# Altium project test_plate.PrjPcb
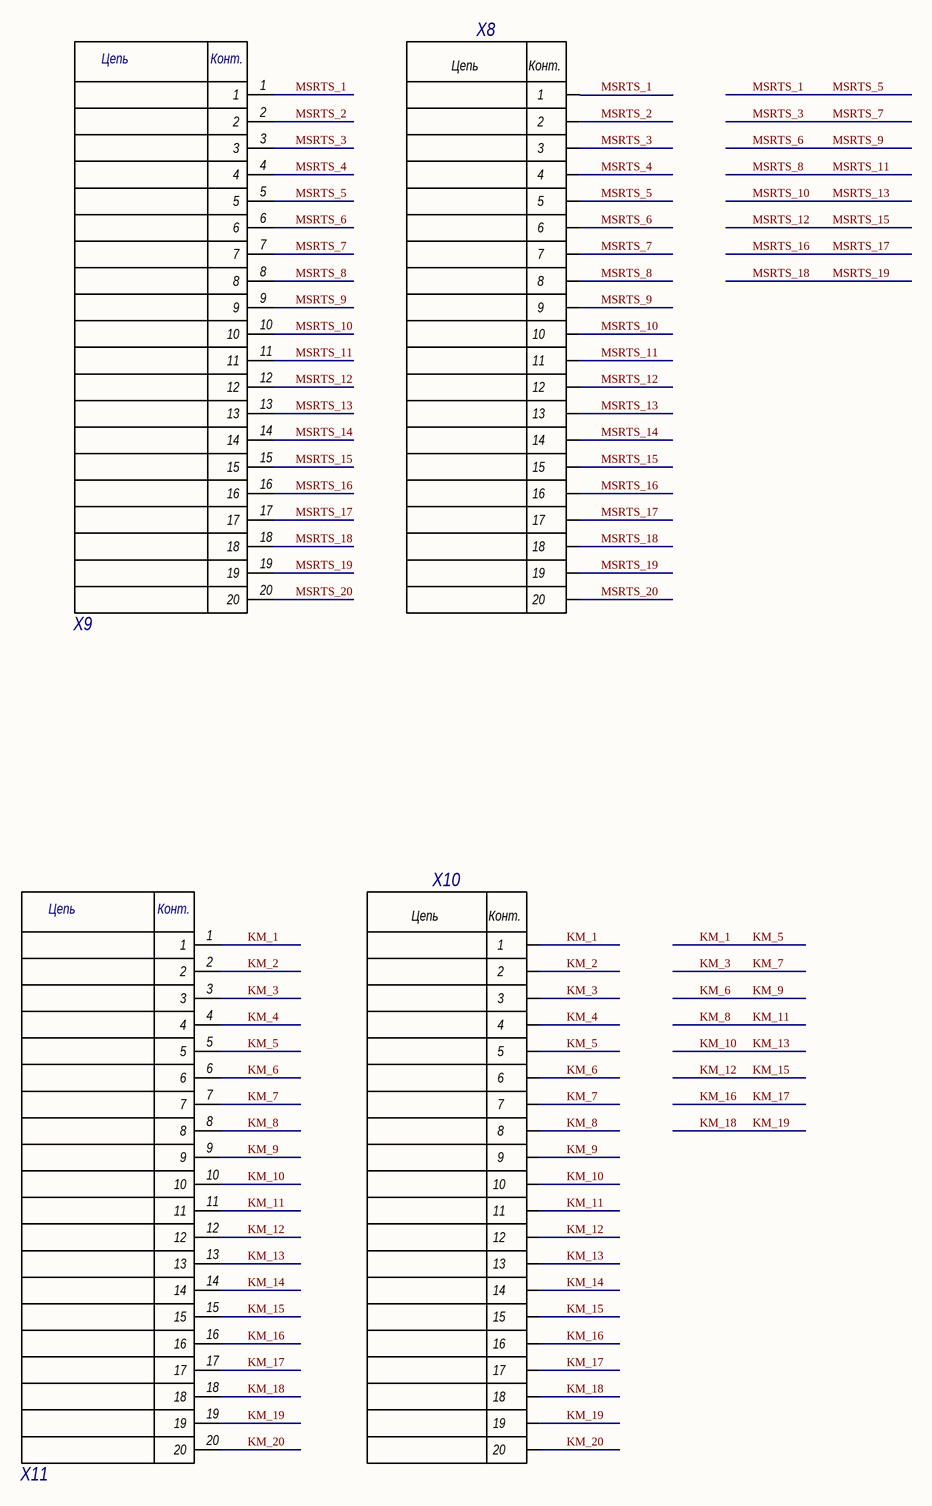
[diagram p0: KM+msrts.SchDoc]
4 sheets, 18 parts. Net scope: global (net labels, ports and power ports of the same name join across sheets).
Board file: test_plate.PcbDoc
Sheets:
  KM+msrts.SchDoc
  NKK+DOF.SchDoc
  SD_SC.SchDoc
  test.SchDoc

## Sheet KM+msrts.SchDoc
size A2

### Parts
X8  PLD-20  [PLD-20]  (value not drawn)
X9  2x10  [5011902017]  (value not drawn)
X10  PLD-20  [PLD-20]  (value not drawn)
X11  2x10  [5011902017]  (value not drawn)

### Nets
KM_1: X10.1 X10.5 X11.1 X11.5  [also labelled KM_5]
KM_2: X10.2 X11.2
KM_3: X10.3 X10.7 X11.3 X11.7  [also labelled KM_7]
KM_4: X10.4 X11.4
KM_6: X10.6 X10.9 X11.6 X11.9  [also labelled KM_9]
KM_10: X10.10 X10.13 X11.10 X11.13  [also labelled KM_13]
KM_11: X10.8 X10.11 X11.8 X11.11  [also labelled KM_8]
KM_12: X10.12 X10.15 X11.12 X11.15  [also labelled KM_15]
KM_14: X10.14 X11.14
KM_16: X10.16 X10.17 X11.16 X11.17  [also labelled KM_17]
KM_18: X10.18 X10.19 X11.18 X11.19  [also labelled KM_19]
KM_20: X10.20 X11.20
MSRTS_1: X8.1 X8.5 X9.1 X9.5  [also labelled MSRTS_5]
MSRTS_2: X8.2 X9.2
MSRTS_3: X8.3 X8.7 X9.3 X9.7  [also labelled MSRTS_7]
MSRTS_4: X8.4 X9.4
MSRTS_6: X8.6 X8.9 X9.6 X9.9  [also labelled MSRTS_9]
MSRTS_10: X8.10 X8.13 X9.10 X9.13  [also labelled MSRTS_13]
MSRTS_11: X8.8 X8.11 X9.8 X9.11  [also labelled MSRTS_8]
MSRTS_12: X8.12 X8.15 X9.12 X9.15  [also labelled MSRTS_15]
MSRTS_14: X8.14 X9.14
MSRTS_16: X8.16 X8.17 X9.16 X9.17  [also labelled MSRTS_17]
MSRTS_18: X8.18 X8.19 X9.18 X9.19  [also labelled MSRTS_19]
MSRTS_20: X8.20 X9.20

### Notes on the sheet
- (in symbol 5011902017) Цепь; Конт.
- (in symbol PLD-20 2.54mm) Цепь; Конт.

### Library data of the parts
X8 X10 = PLD-20 2.54mm: штыри на плату двурядные; PartNumberFrom1C: Штырь PLD-20; Код: 27; 1CType: Штырь; Number of Positions: 20; Pitch - Mating: 2,54 мм; System: Connector; PartNumber: PLD-20 2.54mm; PartNumberFrom1C_accuracy: Штырь PLD-20; OrderCode: PLD-20; Mounting Type: Through Hole; ComponentLink1Description: Технические характеристики
X9 X11 = 5011902017: CONN HEADER SMD 20POS 1MM; PartNumberFrom1C: Вилка Molex 5011902017; Manufacturer: Molex; Код: 181; 1CType: Вилка; Extended Price: $571.24/500; Number of Positions: 20; Number of Positions Loaded: ALL; Pitch - Mating: 0.039" (1.00mm); Row Spacing: 0.105" (2.66mm); System: Connector; PartNumber: 5011902017; PartNumberFrom1C_accuracy: Вилка Molex 5011902017; OrderCode: 5011902017; Unit Price: $1.76; Packaging: Cut Tape (CT); Series: Pico-Clasp 501190; Contact Type: Male Pin; Number of Rows: 2; Mounting Type: Surface Mount; Fastening Type: Latch Holder; Termination: Solder; Contact Finish Thickness: 3.90µin (0.099µm); ComponentLink: https://www.digikey.com/product-detail/en/molex/5011902017/WM7907CT-ND/1531557; ComponentLink1URL: https://www.digikey.com/product-detail/en/molex/5011902017/WM7907CT-ND/1531557; ComponentLink1Description: Технические характеристики

## Sheet NKK+DOF.SchDoc
size A4
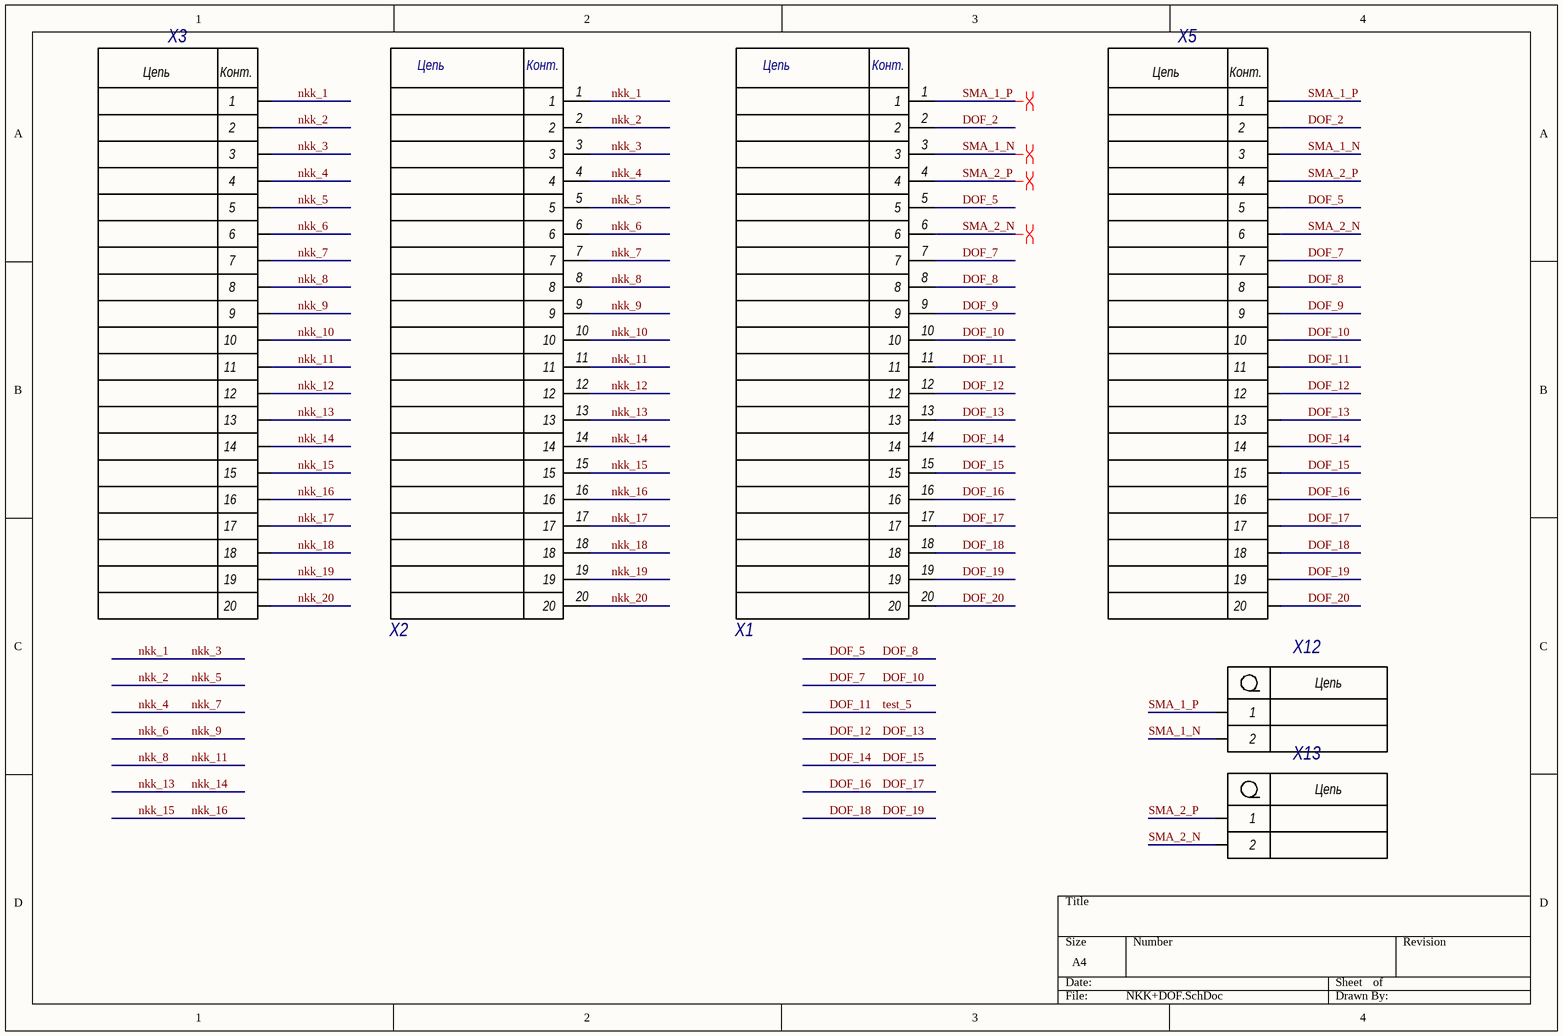
[diagram p1: NKK+DOF.SchDoc]

### Parts
X1  2x10  [5011902017]  (value not drawn)
X2  2x10  [5011902017]  (value not drawn)
X3  PLD-20  [PLD-20]  (value not drawn)
X5  PLD-20  [PLD-20]  (value not drawn)
X12  SMA JACK  [SMA_THROUGH_HOLE]  (value not drawn)
X13  SMA JACK  [SMA_THROUGH_HOLE]  (value not drawn)

### Nets
DOF_2: X1.2 X5.2
DOF_5: X1.5 X1.8 X5.5 X5.8  [also labelled DOF_8]
DOF_9: X1.9 X5.9
DOF_10: X1.7 X1.10 X5.7 X5.10  [also labelled DOF_7]
DOF_11: X1.11 X5.11  [also labelled test_5]
DOF_12: X1.12 X1.13 X5.12 X5.13  [also labelled DOF_13]
DOF_14: X1.14 X1.15 X5.14 X5.15  [also labelled DOF_15]
DOF_16: X1.16 X1.17 X5.16 X5.17  [also labelled DOF_17]
DOF_18: X1.18 X1.19 X5.18 X5.19  [also labelled DOF_19]
DOF_20: X1.20 X5.20
nkk_1: X2.1 X2.3 X3.1 X3.3  [also labelled nkk_3]
nkk_2: X2.2 X2.5 X3.2 X3.5  [also labelled nkk_5]
nkk_4: X2.4 X2.7 X3.4 X3.7  [also labelled nkk_7]
nkk_6: X2.6 X2.9 X3.6 X3.9  [also labelled nkk_9]
nkk_10: X2.10 X3.10
nkk_11: X2.8 X2.11 X3.8 X3.11  [also labelled nkk_8]
nkk_12: X2.12 X3.12
nkk_13: X2.13 X2.14 X3.13 X3.14  [also labelled nkk_14]
nkk_15: X2.15 X2.16 X3.15 X3.16  [also labelled nkk_16]
nkk_17: X2.17 X3.17
nkk_18: X2.18 X3.18
nkk_19: X2.19 X3.19
nkk_20: X2.20 X3.20
SMA_1_N: X1.3 X5.3 X12.2
SMA_1_P: X1.1 X5.1 X12.1
SMA_2_N: X1.6 X5.6 X13.2
SMA_2_P: X1.4 X5.4 X13.1

### Layout directives
differential pair: SMA_1_N, SMA_1_P, SMA_2_N, SMA_2_P

### Notes on the sheet
- (in symbol 5011902017) Цепь; Конт.
- (in symbol PLD-20 2.54mm) Цепь; Конт.
- (in symbol WM5543-ND) Цепь

### Library data of the parts
X1 X2 = 5011902017: as X9 on sheet KM+msrts; PartNumber: 5011902017; PartNumberFrom1C_accuracy: Вилка Molex 5011902017; OrderCode: 5011902017; Unit Price: $1.76; Packaging: Cut Tape (CT); Series: Pico-Clasp 501190; Contact Type: Male Pin; Number of Rows: 2; Mounting Type: Surface Mount; Fastening Type: Latch Holder; Termination: Solder; Contact Finish Thickness: 3.90µin (0.099µm); ComponentLink: https://www.digikey.com/product-detail/en/molex/5011902017/WM7907CT-ND/1531557; ComponentLink1URL: https://www.digikey.com/product-detail/en/molex/5011902017/WM7907CT-ND/1531557; ComponentLink1Description: Технические характеристики
X3 X5 = PLD-20 2.54mm: as X8 on sheet KM+msrts; PartNumber: PLD-20 2.54mm; PartNumberFrom1C_accuracy: Штырь PLD-20; OrderCode: PLD-20; Mounting Type: Through Hole; ComponentLink1Description: Технические характеристики
X12 X13 = WM5543-ND: CONN SMA JACK STR 50 OHM PCB; PartNumberFrom1C: Розетка Molex WM5543-ND; Manufacturer: Molex; Код: 52; 1CType: Розетка; Number of Positions: 1; System: Connector; PartNumber: WM5543-ND; PartNumberFrom1C_accuracy: Розетка Molex WM5543-ND; OrderCode: WM5543-ND; Mounting Type: Through Hole; ComponentLink: http://www.digikey.com/product-detail/en/0733910060/WM5543-ND/1465165; ComponentLink1URL: http://www.digikey.com/product-detail/en/0733910060/WM5543-ND/1465165; ComponentLink1Description: Технические характеристики

## Sheet SD_SC.SchDoc
size A4
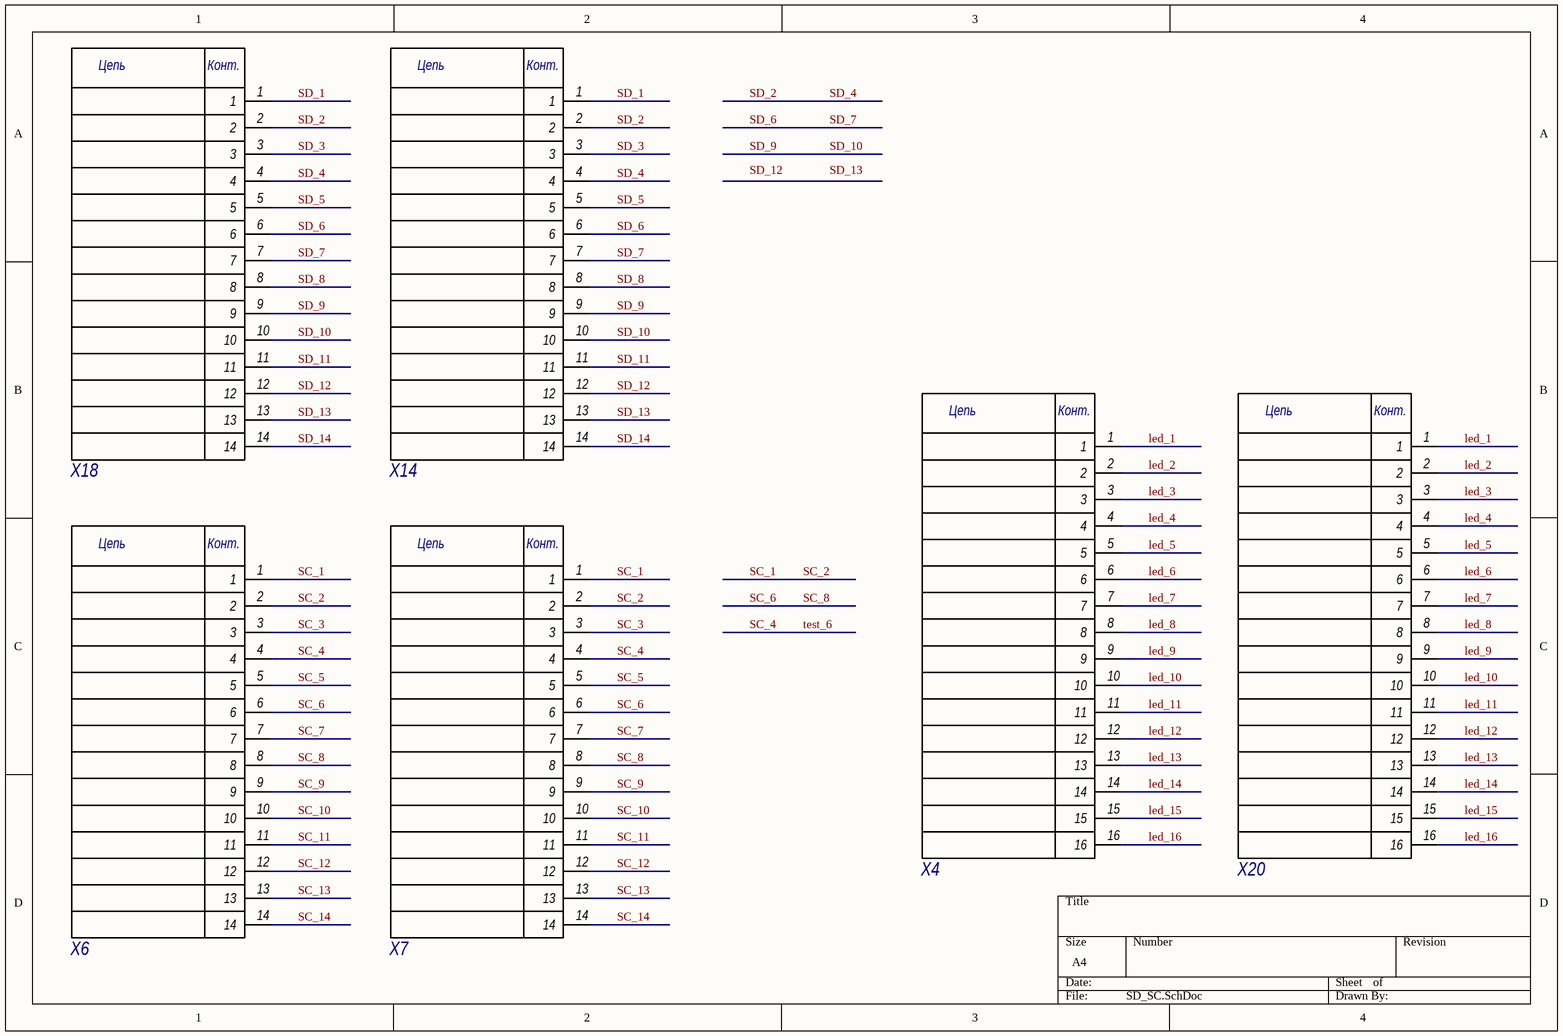
[diagram p2: SD_SC.SchDoc]

### Parts
X4  PLD-16  [PLD-16]  (value not drawn)
X6  2x7  [87832_1420]  (value not drawn)
X7  PLD-14  [PLD-14]  (value not drawn)
X14  PLD-14  [PLD-14]  (value not drawn)
X18  2x7  [87832_1420]  (value not drawn)
X20  2x7  [87832_1620]  (value not drawn)

### Nets
led_1: X4.1 X20.1
led_2: X4.2 X20.2
led_3: X4.3 X20.3
led_4: X4.4 X20.4
led_5: X4.5 X20.5
led_6: X4.6 X20.6
led_7: X4.7 X20.7
led_8: X4.8 X20.8
led_9: X4.9 X20.9
led_10: X4.10 X20.10
led_11: X4.11 X20.11
led_12: X4.12 X20.12
led_13: X4.13 X20.13
led_14: X4.14 X20.14
led_15: X4.15 X20.15
led_16: X4.16 X20.16
SC_1: X6.1 X6.2 X7.1 X7.2  [also labelled SC_2]
SC_3: X6.3 X7.3
SC_4: X6.4 X7.4  [also labelled test_6]
SC_5: X6.5 X7.5
SC_6: X6.6 X6.8 X7.6 X7.8  [also labelled SC_8]
SC_7: X6.7 X7.7
SC_9: X6.9 X7.9
SC_10: X6.10 X7.10
SC_11: X6.11 X7.11
SC_12: X6.12 X7.12
SC_13: X6.13 X7.13
SC_14: X6.14 X7.14
SD_1: X14.1 X18.1
SD_2: X14.2 X14.4 X18.2 X18.4  [also labelled SD_4]
SD_3: X14.3 X18.3
SD_5: X14.5 X18.5
SD_6: X14.6 X14.7 X18.6 X18.7  [also labelled SD_7]
SD_8: X14.8 X18.8
SD_10: X14.9 X14.10 X18.9 X18.10  [also labelled SD_9]
SD_11: X14.11 X18.11
SD_12: X14.12 X18.12
SD_13: X14.13 X18.13
SD_14: X14.14 X18.14

### Notes on the sheet
- Labels drawn without touching a wire or pin: SD_12, SD_13
- (in symbol 87832-1420) Цепь; Конт.
- (in symbol 87832-1620) Цепь; Конт.
- (in symbol PLD-14) Цепь; Конт.
- (in symbol PLD-16) Цепь; Конт.

### Library data of the parts
X4 = PLD-16: штыри на плату; PartNumberFrom1C: Штырь PLD-16; Код: 191; 1CType: Штырь; Number of Positions: 16; System: Connector; PartNumber: PLD-16; PartNumberFrom1C_accuracy: Штырь PLD-16; OrderCode: PLD-16; Mounting Type: Through Hole; Termination: Solder; ComponentLink: https://www.chipdip.ru/product/pld-16; ComponentLink1URL: https://www.chipdip.ru/product/pld-16; ComponentLink1Description: Технические характеристики
X6 X18 = 87832-1420: Connector Header Surface Mount 14 position 0.079" (2.00mm); PartNumberFrom1C: Вилка Molex 87832-1420; Manufacturer: Molex; Код: 180; 1CType: Вилка; Extended Price: $8,807.50/10000; Number of Positions: 14; Number of Positions Loaded: All; PartNumber: 87832-1420; PartNumberFrom1C_accuracy: Вилка Molex 87832-1420; OrderCode: 87832-1420; Unit Price: $1.83; Packaging: Tube; Series: Milli-Grid 87832; Contact Type: Male Pin; Pitch - Mating: 0.079" (2.00mm); Number of Rows: 2; Row Spacing: 0.079" (2.00mm); Mounting Type: Surface Mount; Fastening Type: Latch Holder; Termination: Solder; Contact Finish Thickness: 15.0µin (0.38µm); ComponentLink: https://www.digikey.com/product-detail/en/molex/0878321416/WM8613-ND/3044734; ComponentLink1URL: https://www.digikey.com/product-detail/en/molex/0878321416/WM8613-ND/3044734; ComponentLink1Description: Технические характеристики; System: Connector
X7 X14 = PLD-14: штыри на плату; PartNumberFrom1C: Штырь PLD-14; Код: 318; 1CType: Штырь; Minimum Quantity: 1; Number of Positions: 14; Pitch - Mating: 2,54 мм; System: Connector; PartNumber: PLD-14; PartNumberFrom1C_accuracy: Штырь PLD-14; OrderCode: PLD-14; Mounting Type: Through Hole; Termination: Solder; ComponentLink: https://www.chipdip.ru/product/pld-16; ComponentLink1URL: https://www.chipdip.ru/product/pld-16; ComponentLink1Description: Технические характеристики
X20 = 87832-1620: Connector Header Surface Mount 16 position 0.079" (2.00mm); PartNumberFrom1C: Вилка Molex 87832-1620; Manufacturer: Molex; Код: 264; 1CType: Вилка; Extended Price: $9,662.90/10000; Minimum Quantity: 1; Number of Positions: 16; Number of Positions Loaded: All; PartNumber: 87832-1620; PartNumberFrom1C_accuracy: Вилка Molex 87832-1620; OrderCode: 87832-1620; Unit Price: $2.01; Packaging: Tube; Series: Milli-Grid 87832; Contact Type: Male Pin; Pitch - Mating: 0.079" (2.00mm); Number of Rows: 2; Row Spacing: 0.079" (2.00mm); Mounting Type: Surface Mount; Fastening Type: Latch Holder; Termination: Solder; Contact Finish Thickness: 15.0µin (0.38µm); ComponentLink: https://www.digikey.com/products/en?keywords=87832-1620; ComponentLink1URL: https://www.digikey.com/products/en?keywords=87832-1620; ComponentLink1Description: Технические характеристики; System: Connector

## Sheet test.SchDoc
size A4
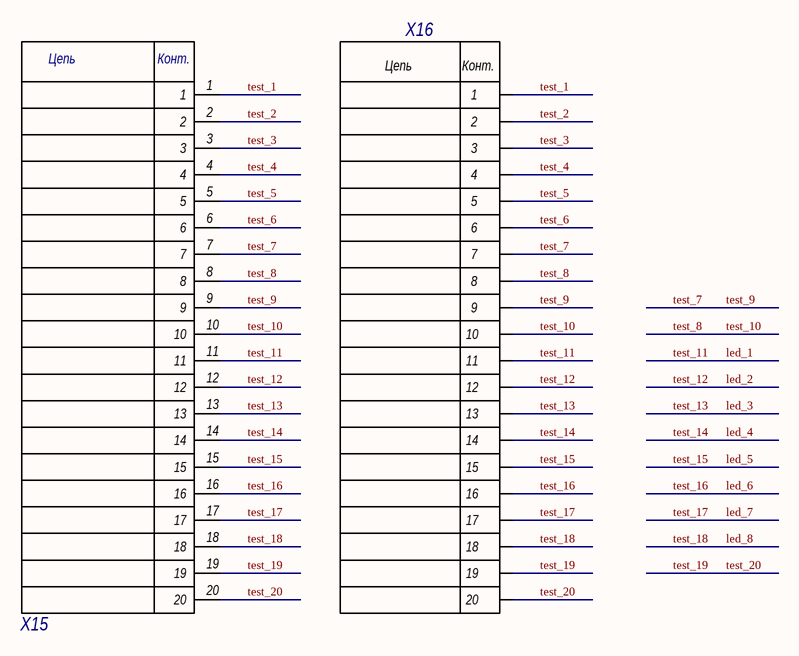
[diagram p3: test.SchDoc]

### Parts
X15  87831-2020  [87831-2020]  (value not drawn)
X16  PLD-20  [PLD-20]  (value not drawn)

### Nets
led_1: X15.11 X16.11  [also labelled test_11]
led_2: X15.12 X16.12  [also labelled test_12]
led_3: X15.13 X16.13  [also labelled test_13]
led_4: X15.14 X16.14  [also labelled test_14]
led_5: X15.15 X16.15  [also labelled test_15]
led_6: X15.16 X16.16  [also labelled test_16]
led_7: X15.17 X16.17  [also labelled test_17]
led_8: X15.18 X16.18  [also labelled test_18]
test_1: X15.1 X16.1
test_2: X15.2 X16.2
test_3: X15.3 X16.3
test_4: X15.4 X16.4
test_5: X15.5 X16.5  [project net DOF_11]
test_6: X15.6 X16.6  [project net SC_4]
test_7: X15.7 X15.9 X16.7 X16.9  [also labelled test_9]
test_10: X15.8 X15.10 X16.8 X16.10  [also labelled test_8]
test_19: X15.19 X15.20 X16.19 X16.20  [also labelled test_20]

### Notes on the sheet
- (in symbol 87831-2020) Цепь; Конт.
- (in symbol PLD-20 2.54mm) Цепь; Конт.

### Library data of the parts
X15 = 87831-2020: CONN HEADER VERT 20POS 2MM; PartNumberFrom1C: Вилка Molex 87831-2020; Manufacturer: Molex; Код: 206; 1CType: Вилка; Extended Price: $6,864.65/5000; Minimum Quantity: 1; Number of Positions: 20; Number of Positions Loaded: All; Pitch - Mating: 0.079" (2.00mm); System: Connector; PartNumber: 87831-2020; PartNumberFrom1C_accuracy: Вилка Molex 87831-2020; OrderCode: 87831-2020; Unit Price: $2.64; Packaging: Tube; Series: Milli-Grid 87831; Contact Type: Male Pin; Number of Rows: 2; Row Spacing: 0.079" (2.00mm); Contact Mating Length: 0.141" (3.60mm); Mounting Type: Male Pin; Fastening Type: Latch Holder; Termination: Solder; Current Rating: -; Operating Temperature: -; Contact Finish: Gold; Contact Finish Thickness: 15.0µin (0.38µm); ComponentLink: https://www.digikey.com/product-detail/en/molex/0878312020/WM18564-ND/679682; ComponentLink1URL: https://www.digikey.com/product-detail/en/molex/0878312020/WM18564-ND/679682; ComponentLink1Description: Технические характеристики
X16 = PLD-20 2.54mm: as X8 on sheet KM+msrts; PartNumber: PLD-20 2.54mm; PartNumberFrom1C_accuracy: Штырь PLD-20; OrderCode: PLD-20; Mounting Type: Through Hole; ComponentLink1Description: Технические характеристики

## Nets that join several sheets
DOF_11: NKK+DOF (X1.11 X5.11), test (X15.5 X16.5)
led_1: SD_SC (X4.1 X20.1), test (X15.11 X16.11)
led_2: SD_SC (X4.2 X20.2), test (X15.12 X16.12)
led_3: SD_SC (X4.3 X20.3), test (X15.13 X16.13)
led_4: SD_SC (X4.4 X20.4), test (X15.14 X16.14)
led_5: SD_SC (X4.5 X20.5), test (X15.15 X16.15)
led_6: SD_SC (X4.6 X20.6), test (X15.16 X16.16)
led_7: SD_SC (X4.7 X20.7), test (X15.17 X16.17)
led_8: SD_SC (X4.8 X20.8), test (X15.18 X16.18)
SC_4: SD_SC (X6.4 X7.4), test (X15.6 X16.6)